# EAGLE design light (EAGLE 5.06)
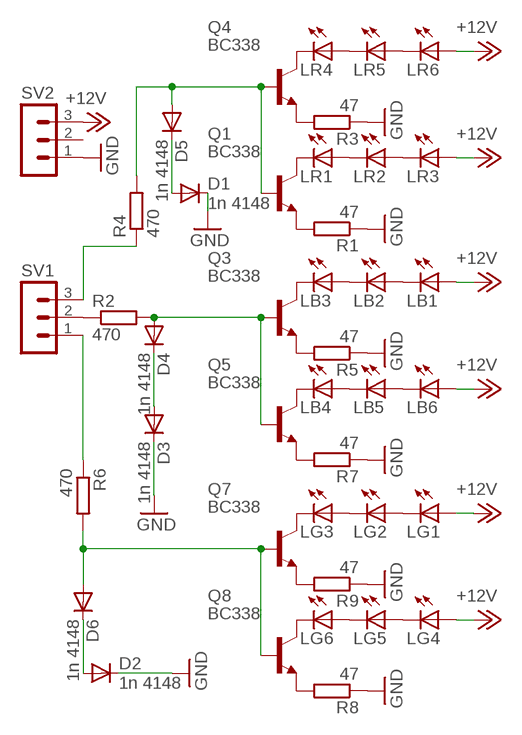
[diagram p0: schematic, sheet 1]

## Parts
D1  1n 4148  DIODE-D-2.5  [D-2.5]
D2  1n 4148  DIODE-D-2.5  [D-2.5]
D3  1n 4148  DIODE-D-2.5  [D-2.5]
D4  1n 4148  DIODE-D-2.5  [D-2.5]
D5  1n 4148  DIODE-D-2.5  [D-2.5]
D6  1n 4148  DIODE-D-2.5  [D-2.5]
LB1  LEDSFH480  [SFH480]
LB2  LEDSFH482  [SFH482]
LB3  LEDSFH482  [SFH482]
LB4  LEDSFH482  [SFH482]
LB5  LEDSFH480  [SFH480]
LB6  LEDSFH480  [SFH480]
LG1  LEDSFH482  [SFH482]
LG2  LEDSFH482  [SFH482]
LG3  LEDSFH482  [SFH482]
LG4  LEDSFH480  [SFH480]
LG5  LEDSFH482  [SFH482]
LG6  LEDSFH482  [SFH482]
LR1  LEDSFH480  [SFH480]
LR2  LEDSFH480  [SFH480]
LR3  LEDSFH482  [SFH482]
LR4  LEDSFH482  [SFH482]
LR5  LEDSFH482  [SFH482]
LR6  LEDSFH482  [SFH482]
Q1  BC338  [TO92-EBC]
Q3  BC338  [TO92-EBC]
Q4  BC338  [TO92-EBC]
Q5  BC338  [TO92-EBC]
Q7  BC338  [TO92-EBC]
Q8  BC338  [TO92-EBC]
R1  47  R-EU_0204/2V  [0204V]
R2  470  R-EU_0204/2V  [0204V]
R3  47  R-EU_0204/7  [0204/7]
R4  470  R-EU_0204/2V  [0204V]
R5  47  R-EU_0204/2V  [0204V]
R6  470  R-EU_0204/2V  [0204V]
R7  47  R-EU_0204/7  [0204/7]
R8  47  R-EU_0204/2V  [0204V]
R9  47  R-EU_0204/5  [0204/5]
SV1  MA03-1  [MA03-1]
SV2  MA03-1  [MA03-1]

## Nets
+12V: LB1.A LB6.A LG1.A LG4.A LR3.A LR6.A SV2.3
GND: D1.C D2.C D3.C R1.1 R3.1 R5.1 R7.1 R8.1 R9.1 SV2.1
N$1: LR2.A LR3.K(C)
N$2: LR1.A LR2.K(C)
N$3: LR5.A LR6.K(C)
N$4: LR4.A LR5.K(C)
N$5: Q4.E R3.2
N$6: D1.A D5.C
N$7: LB1.K(C) LB2.A
N$8: LB2.K(C) LB3.A
N$9: LB5.A LB6.K(C)
N$10: LB4.A LB5.K(C)
N$11: LB3.K(C) Q3.C
N$12: LB4.K(C) Q5.C
N$13: LR1.K(C) Q1.C
N$14: LR4.K(C) Q4.C
N$15: Q1.E R1.2
N$16: D5.A Q1.B Q4.B R4.2
N$17: D2.A D6.C
N$18: Q3.E R5.2
N$19: D4.A Q3.B Q5.B R2.2
N$20: D3.A D4.C
N$21: Q5.E R7.2
N$22: R2.1 SV1.2
N$23: LG1.K(C) LG2.A
N$24: LG2.K(C) LG3.A
N$25: LG4.K(C) LG5.A
N$26: LG5.K(C) LG6.A
N$27: LG3.K(C) Q7.C
N$28: LG6.K(C) Q8.C
N$29: Q7.E R9.2
N$30: D6.A Q7.B Q8.B R6.2
N$32: Q8.E R8.2
N$41: R4.1 SV1.3
N$42: R6.1 SV1.1
Unconnected: SV2.2

## Library data of the parts
D1-D6 = diode:DIODE-: DIODE
LB1-LB6 LG1-LG6 LR1-LR6 = led:LED: LED OSRAM: - CHIPLED LG R971, LG N971, LY N971, LG Q971, LY Q971, LO R971, LY R971 LH N974, LH R974 LS Q976, LO Q976, LY Q976 LO Q996 - Hyper CHIPLED LW Q18S LB Q993, LB Q99A, LB R99A - SideLED LS A670, LO A670, LY A670, LG A670, LP A670 LB A673, LV A673, LT A673, LW A673 LH A674 LY A675 LS A676, LA A676, LO A676, LY A676, LW A676 LS A679, LY A679, LG A679 - Hyper Micro SIDELED® LS Y876, LA Y876, LO Y876, LY Y876 LT Y87S - SmartLED LW L88C, LW L88S LB L89C, LB L89S, LG L890 LS L89K, LO L89K, LY L89K LS L896, LA L896, LO L896, LY L896 - TOPLED LS T670, LO T670, LY T670, LG T670, LP T670 LSG T670, LSP T670, LSY T670, LOP T670, LYG T670 LG T671, LOG T671, LSG T671 LB T673, LV T673, LT T673, LW T673 LH T674 LS T676, LA T676, LO T676, LY T676, LB T676, LH T676, LSB T676, LW T676 LB T67C, LV T67C, LT T67C, LS T67K, LO T67K, LY T67K, LW E67C LS E67B, LA E67B, LO E67B, LY E67B, LB E67C, LV E67C, LT E67C LW T67C LS T679, LY T679, LG T679 LS T770, LO T770, LY T770, LG T770, LP T770 LB T773, LV T773, LT T773, LW T773 LH T774 LS E675, LA E675, LY E675, LS T675 LS T776, LA T776, LO T776, LY T776, LB T776 LHGB T686 LT T68C, LB T68C - Hyper Mini TOPLED® LB M676 - Mini TOPLED Santana® LG M470 LS M47K, LO M47K, LY M47K Source: http://www.osram.convergy.de/
Q1 Q3-Q5 Q7 Q8 = transistor-npn:BC338*: NPN Transistor
R1-R9 = rcl:R-EU_: RESISTOR, European symbol
SV1 SV2 = con-lstb:MA03-1: PIN HEADER

## Board
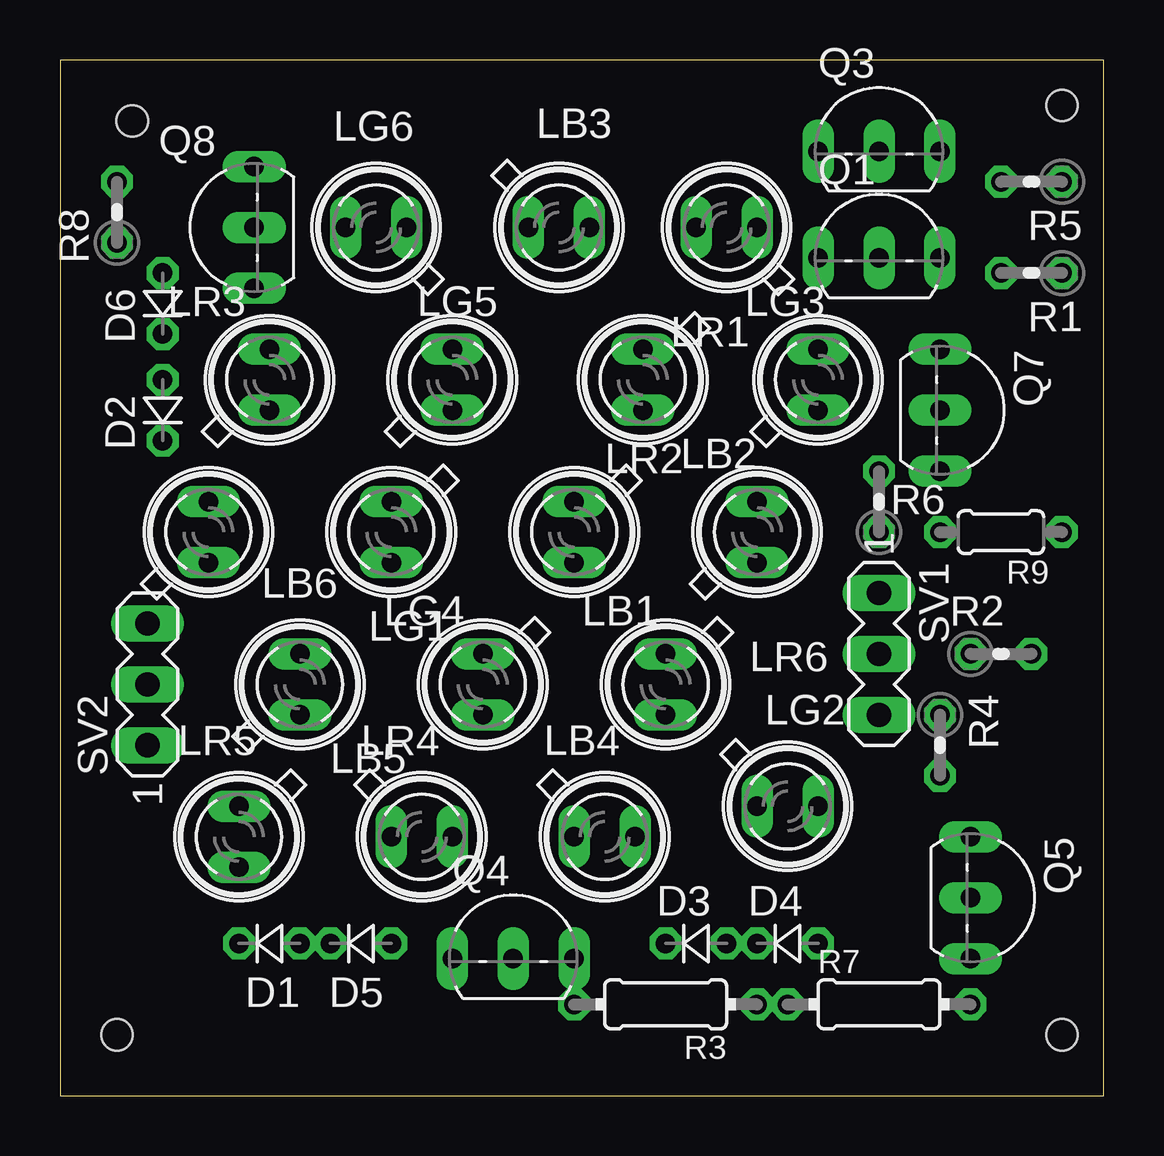
[diagram p1: board, top side]
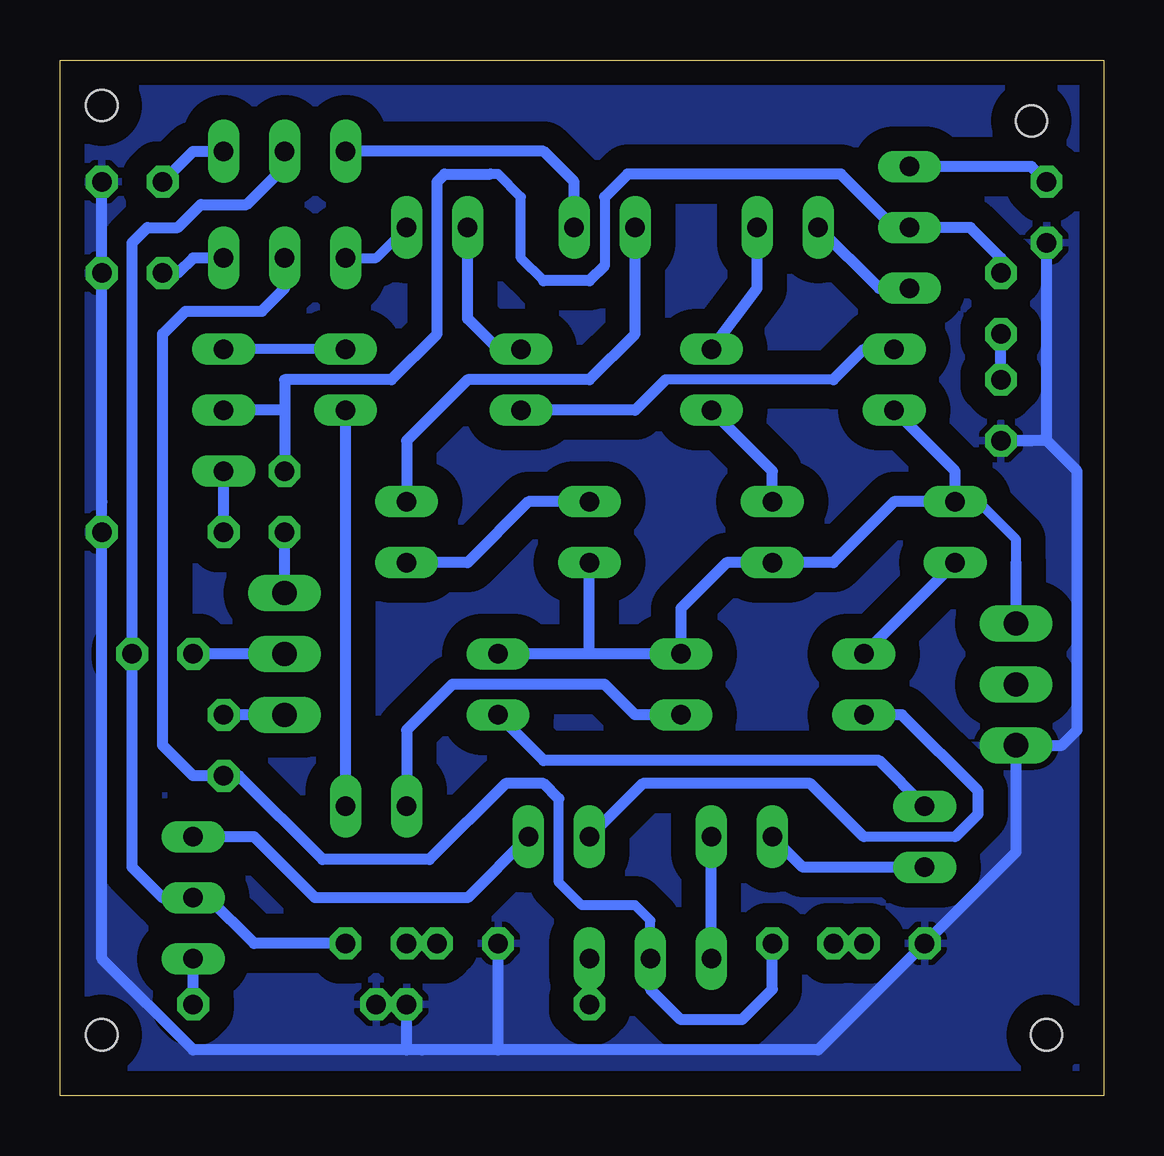
[diagram p2: board, bottom side, seen from below]

Size 43.48 x 43.17 mm. Coordinates in mm from the lower left corner, seen from the top.
Outline: 0,0 43.48,0 43.48,43.17 0,43.17 0,0
Copper layers (1*16): Top 0.035mm / dielectric 1.5mm / Bottom 0.035mm
Design rules "default": minimum track width 10mil, minimum drill 24mil, track to track 8mil, track to pad 8mil, pad to pad 8mil, via to via 8mil, smd to smd 8mil, copper to edge 40mil, drill to drill 8mil, minimum pad ring 10mil, minimum via ring 8mil, stop-mask expansion 4mil, vias tented up to drill 0mil, thermal gap 10mil
Holes 1.3 mm at 3.01,40.64 41.74,41.27 41.74,2.54 2.38,2.54

### Footprints (pad centres in the part's own frame; a part is rotated, then mirrored left to right if it is on the bottom)
D-2.5 = drill 0.813 octagon: A 1.27,0; C -1.27,0
SFH480 = drill 0.813 long: A 1.27,0; K -1.27,0
SFH482 = drill 0.813 long: A -1.27,0; K 1.27,0
TO92-EBC = drill 0.813 long: B 0,-1.27; C -2.54,-1.27; E 2.54,-1.27
0204V = drill 0.813 octagon: 1 -1.27,0; 2 1.27,0
0204/7 = drill 0.813 octagon: 1 -3.81,0; 2 3.81,0
0204/5 = drill 0.813 octagon: 1 -2.54,0; 2 2.54,0
MA03-1 = drill 1.016 long: 1 -2.54,0; 2 0,0; 3 2.54,0

### Placement (x,y rotation side)
D1  [D-2.5]  8.73,6.34 0 top
D2  [D-2.5]  4.28,28.57 90 top
D3  [D-2.5]  26.5,6.34 0 top
D4  [D-2.5]  30.31,6.34 0 top
D5  [D-2.5]  12.54,6.34 0 top
D6  [D-2.5]  4.28,33.02 90 top
LB1  21.42,23.49 270 top
LB2  29.04,23.49 90 top
LB3  20.79,36.19 0 top
LB4  22.7,10.79 0 top
LB5  10,17.14 90 top
LB6  6.18,23.49 90 top
LG1  17.61,17.14 270 top
LG2  30.31,12.06 0 top
LG3  31.58,29.84 90 top
LG4  13.81,23.49 270 top
LG5  16.34,29.84 90 top
LG6  13.17,36.19 180 top
LR1  27.77,36.19 180 top
LR2  24.28,29.84 270 top
LR3  8.73,29.84 90 top
LR4  15.08,10.79 0 top
LR5  7.46,10.79 270 top
LR6  25.23,17.14 270 top
Q1  34.12,36.19 0 top
Q3  34.12,40.64 0 top
Q4  18.88,6.98 0 top
Q5  39.2,8.25 270 top
Q7  37.94,28.57 270 top
Q8  6.82,36.19 90 top
R1  [0204V]  40.48,34.29 180 top
R2  [0204V]  39.2,18.41 0 top
R3  [0204/7]  25.23,3.8 180 top
R4  [0204V]  36.66,14.6 270 top
R5  [0204V]  40.48,38.1 180 top
R6  [0204V]  34.12,24.76 90 top
R7  [0204/7]  34.12,3.8 0 top
R8  [0204V]  2.38,36.83 90 top
R9  [0204/5]  39.2,23.49 180 top
SV1  34.12,18.41 270 top
SV2  3.64,17.14 90 top

### Tracks (layer width: path | path; a pad name or v marks a point on that pad's centre or on a via)
+12V
  Bottom 0.406: 3.64,22.22 3.64,23.17 5.23,24.76 LB6.A
  Bottom 0.457: LR3.A 6.18,26.03 LB6.A 8.73,24.76 11.27,22.22 LG4.A 15.71,22.22 17.61,20.31 LG1.A 21.42,18.41 | 21.42,18.41 LB1.A | 21.42,18.41 LR6.A | SV2.3 3.64,22.22
GND
  Bottom 0.305: 28.41,1.9 29.04,1.9
  Bottom 0.406: 41.74,24.76 R9.1
  Bottom 0.457: 25.23,1.9 11.9,1.9 D1.C 3.64,10.16 SV2.1 1.74,14.6 1.1,15.24 1.1,26.03 2.38,27.3 | 25.23,1.9 28.41,1.9 37.94,1.9 41.74,5.71 41.74,24.76 R1.1 R5.1 | 25.23,1.9 D3.C | 29.04,1.9 R3.1 R7.1 | 3.01,27.3 D2.C 2.38,27.3 | 2.38,27.3 R8.1
  pour Bottom (isolate 1.016): -0.17,42.54 43.65,42.54 43.65,0.63 -0.17,0.63
N$1
  Bottom 0.406: 11.27,29.84 18.25,29.84
  Bottom 0.457: LR2.A 19.52,28.57 18.25,29.84 | 11.27,29.84 10,31.11 LR3.K
N$2
  Bottom 0.457: LR1.A 26.5,32.38 25.23,31.11 LR2.K
N$3
  Bottom 0.457: LR6.K 23.33,13.97 9.36,13.97 LR5.A
N$4
  Bottom 0.457: LR4.A 12.54,9.52 LR5.K
N$5
  Bottom 0.457: R3.2 Q4.E
N$6
  Bottom 0.406: D1.A D5.C
N$7
  Bottom 0.457: LB2.A 26.5,22.22 23.96,24.76 LB1.K
N$8
  Bottom 0.457: LB2.K 29.04,27.3 26.5,29.84 21.42,29.84 19.52,31.74 LB3.A
N$9
  Bottom 0.457: LB5.A LB6.K
N$10
  Bottom 0.406: 6.18,10.79 10,10.79
  Bottom 0.457: LB5.K 8.41,15.87 5.23,12.7 5.23,11.74 6.18,10.79 | 10,10.79 12.22,13.01 19.2,13.01 LB4.A
N$11
  Bottom 0.457: LB3.K 22.06,38.1 23.33,39.37 Q3.C
N$12
  Bottom 0.457: LB4.K 26.5,8.25 32.85,8.25 35.39,10.79 Q5.C
N$13
  Bottom 0.406: Q1.C 30.31,34.92 LR1.K
N$14
  Bottom 0.457: Q4.C LR4.K
N$15
  Bottom 0.457: Q1.E 37.94,34.92 38.57,34.29 R1.2
N$16
  Bottom 0.406: 22.7,12.38 22.7,8.89 21.74,7.93 19.52,7.93 18.88,7.3 Q4.B
  Bottom 0.457: 22.7,12.38 23.33,13.01 24.92,13.01 28.09,9.84 32.54,9.84 36.03,13.33 R4.2 37.94,13.33 39.2,14.6 39.2,31.74 38.25,32.7 35.08,32.7 34.12,33.65 Q1.B | D5.A 13.81,4.44 15.08,3.17 17.61,3.17 18.88,4.44 Q4.B
N$17
  Bottom 0.457: D2.A D6.C
N$18
  Bottom 0.457: R5.2 37.94,39.37 Q3.E
N$19
  Bottom 0.457: D4.A 35.39,6.34 37.3,8.25 Q5.B 39.2,8.25 40.48,9.52 R2.2 40.48,35.55 39.84,36.19 38.57,36.19 37.62,37.14 35.71,37.14 34.12,38.73 Q3.B
N$20
  Bottom 0.457: D3.A D4.C
N$21
  Bottom 0.457: R7.2 Q5.E
N$22
  Bottom 0.457: SV1.2 R2.1
N$23
  Bottom 0.457: LG2.A 29.04,15.24 27.14,17.14 20.79,17.14 19.52,15.87 LG1.K
N$24
  Bottom 0.457: LG2.K LG3.A
N$25
  Bottom 0.457: LG4.K 13.81,26.03 LG5.A
N$26
  Bottom 0.457: LG5.K 14.44,33.65 LG6.A
N$27
  Bottom 0.406: LG3.K Q7.C
N$28
  Bottom 0.457: LG6.K 9.36,33.65 Q8.C
N$29
  Bottom 0.457: R9.2 Q7.E
N$30
  Bottom 0.406: 20.79,37.46 20.79,34.6 | 23.33,33.97 24.28,34.92 24.28,37.46 25.23,38.41 25.55,38.41
  Bottom 0.457: 20.79,34.6 21.42,33.97 23.33,33.97 | 25.55,38.41 27.46,38.41 27.77,38.1 27.77,31.74 29.68,29.84 34.12,29.84 34.12,28.57 | 34.12,28.57 Q7.B | 34.12,28.57 R6.2 | 20.79,37.46 19.84,38.41 10.95,38.41 8.73,36.19 Q8.B 5.55,36.19 4.28,34.92 D6.A
N$32
  Bottom 0.457: Q8.E 3.01,38.73 R8.2
N$41
  Bottom 0.457: SV1.3 R4.1
N$42
  Bottom 0.457: SV1.1 R6.1